# Altium project HU_revB.PrjPcb (part 2 of 4)

## Sheet 5V_REG.SchDoc
size B; SheetNumber: 5; SheetTotal: 17
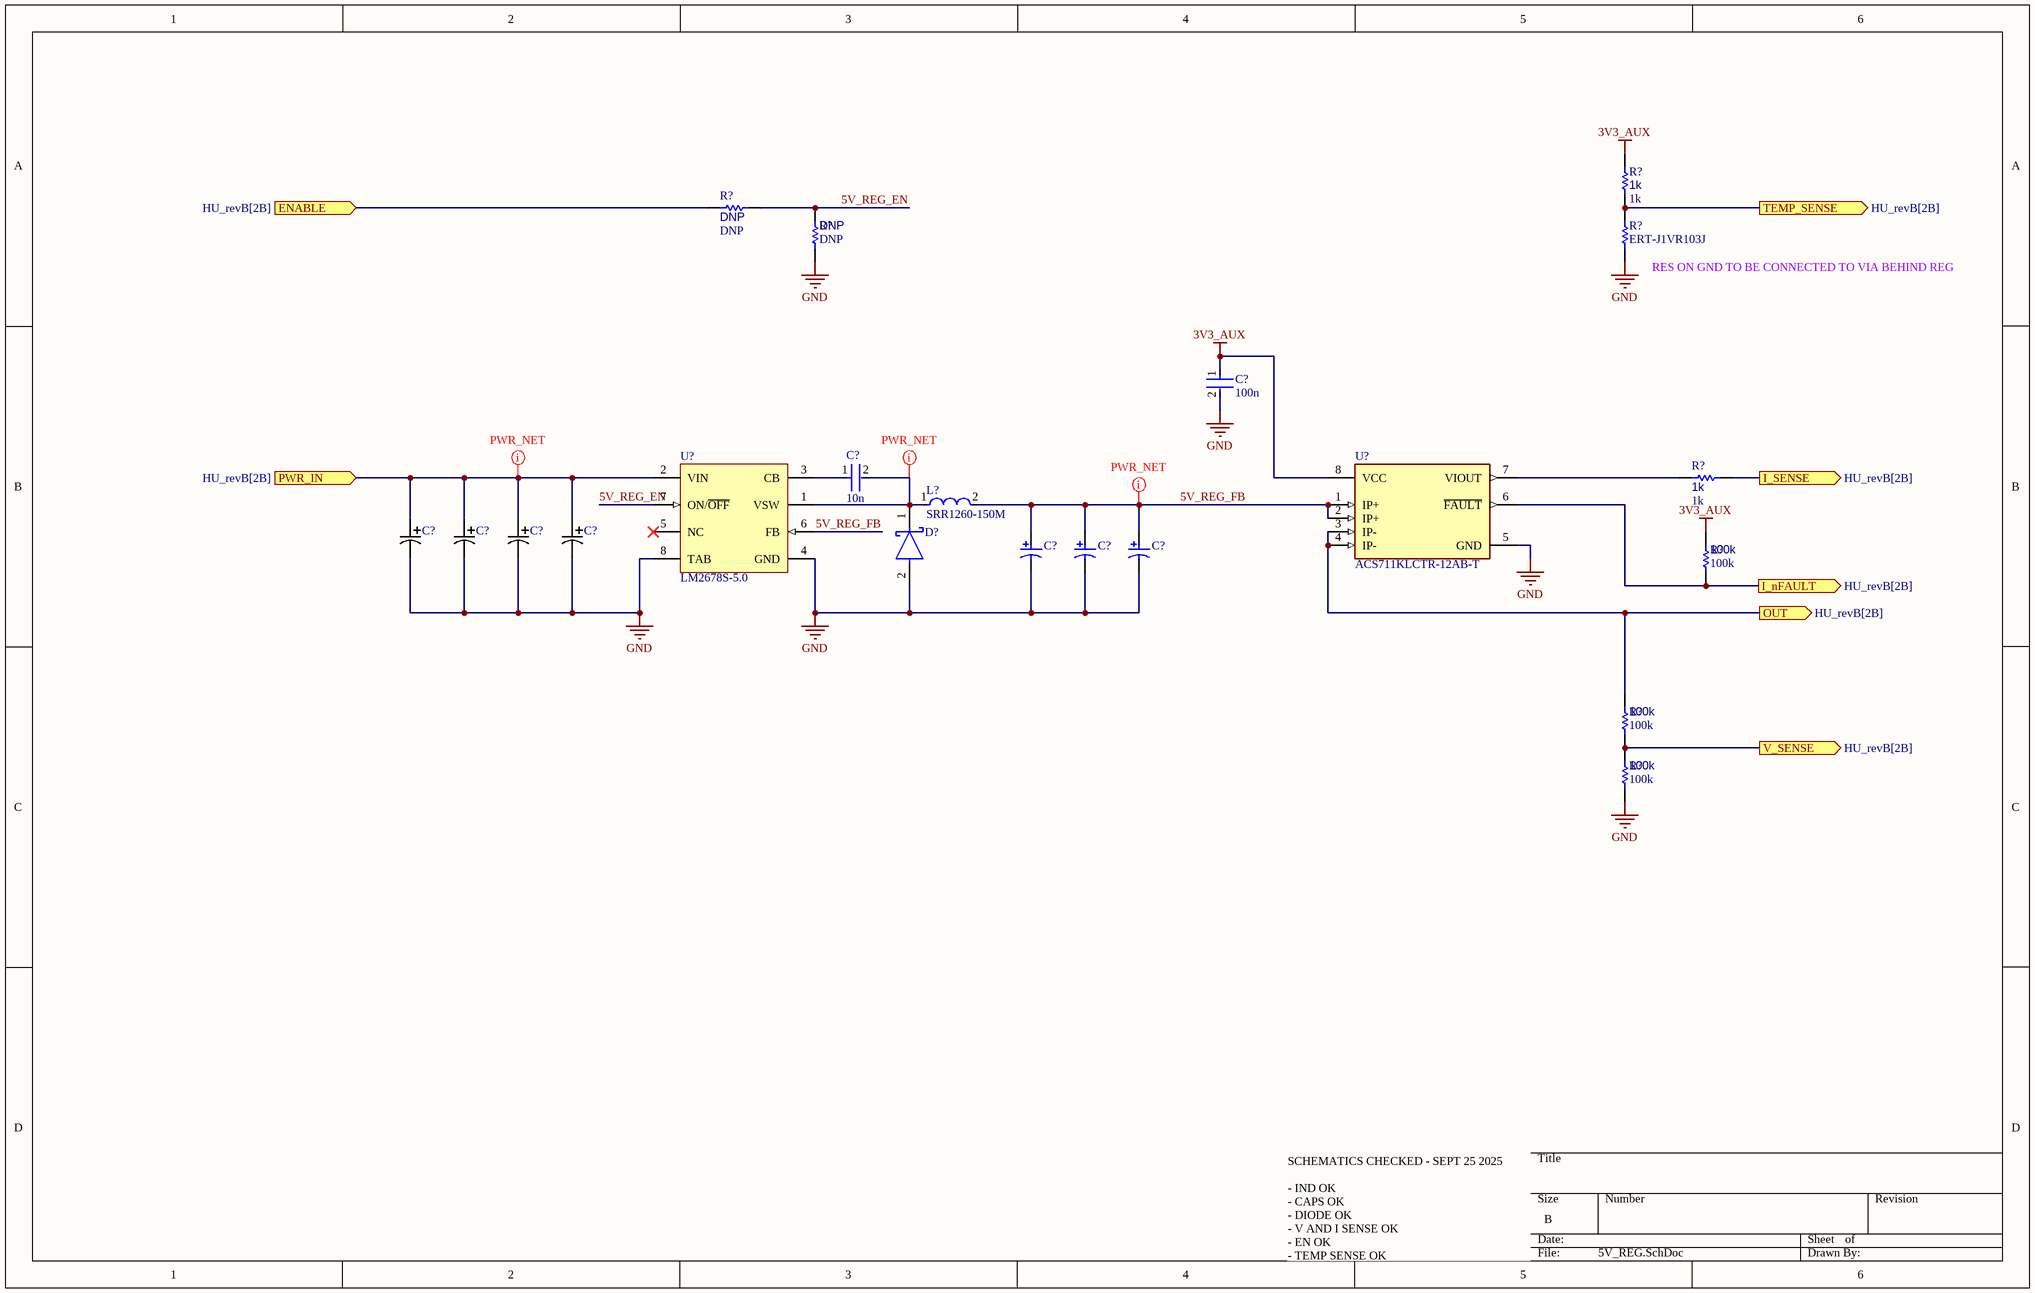
[diagram p5: 5V_REG.SchDoc]

### Parts
(Parts that share a designator on the sheet are numbered #1, #2 ... from top to bottom, then left to right.)
C36  100n  [FP-0402-L_1_0_0_05-W_0_5-IPC_A]
C37  10n  [FP-0402-L_1_0_0_05-W_0_5-IPC_A]
C?#1  T495D106M035ATE260  [T495D106M035ATE260-Footprint-1]  (value not drawn)
C?#2  T495D106M035ATE260  [T495D106M035ATE260-Footprint-1]  (value not drawn)
C?#3  T495D106M035ATE260  [T495D106M035ATE260-Footprint-1]  (value not drawn)
C?#4  T495D106M035ATE260  [T495D106M035ATE260-Footprint-1]  (value not drawn)
C?#5  T495D157K010ATE100  [KEMT-T495-D_L]  (value not drawn)
C?#6  T495D157K010ATE100  [KEMT-T495-D_L]  (value not drawn)
C?#7  T495D157K010ATE100  [KEMT-T495-D_L]  (value not drawn)
D7  B540C-13-F  [FP-SMC-MFG]  (value not drawn)
L?#1  SRR1260-150M  [FP-SRR1260-MFG]
R40  1k  [R0603B]
R41  DNP  [R0603B]
R42  DNP  [R0603B]
R43  ERT-J1VR103J  [RESC1608X90X30ML15T20]
R44  1k  [R0603B]
R45  100k  [R0603B]
R46  100k  [R0603B]
R47  100k  [R0603B]
U4  LM2678S-5.0  [KTW0007B_N]
U5  ACS711KLCTR-12AB-T  [FP-LC-8-IPC_C]

### Ports
ENABLE (in, see HU_revB[2B]), I_nFAULT (out, see HU_revB[2B]), I_SENSE (out, see HU_revB[2B]), OUT (out, see HU_revB[2B]), PWR_IN (in, see HU_revB[2B]), TEMP_SENSE (out, see HU_revB[2B]), V_SENSE (out, see HU_revB[2B])

### Nets
3V3_AUX: C36.1 R40.1 R45.2 U5.8(VCC)  [project net GPIO_VREF]
5V_MAIN: R46.2 U5.3(IP-) U5.4(IP-) ; port OUT
GND: C36.2 C?#1.2 C?#2.2 C?#3.2 C?#4.2 C?#5.2 C?#6.2 C?#7.2 D7.2(A) R42.1 R43.1 R47.1 U4.4(GND) U4.8(TAB) U5.5(GND)
5V_REG_EN: R41.1 R42.2 U4.7(ON/~{OFF})
5V_REG_FB: C?#5.1 C?#6.1 C?#7.1 L?#1.2 U4.6(FB) U5.1(IP+) U5.2(IP+)
CAN_INH: R41.2 ; port ENABLE
NetC37_1: C37.1 U4.3(CB)
NetC37_2: C37.2 D7.1(C) L?#1.1 U4.1(VSW)
NetC?#1_1: C?#1.1 C?#2.1 C?#3.1 C?#4.1 U4.2(VIN) ; port PWR_IN
NetR40_2: R40.2 R43.2 ; port TEMP_SENSE
NetR44_1: R44.1 ; port I_SENSE
NetR44_2: R44.2 U5.7(VIOUT)
NetR45_1: R45.1 U5.6(~{FAULT}) ; port I_nFAULT
NetR46_1: R46.1 R47.2 ; port V_SENSE

Not connected (* = marked no-connect by the designer): U4 5(NC)*

### Layout directives
net class PWR: 5V_REG_FB, NetC37_2, NetC?#1_1

### Notes on the sheet
- (near R43) RES ON GND TO BE CONNECTED TO VIA BEHIND REG
- SCHEMATICS CHECKED - SEPT 25 2025
  - IND OK
  - CAPS OK
  - DIODE OK
  - V AND I SENSE OK
  - EN OK
  - TEMP SENSE OK

### Library data of the parts
C36 C37 = CMP-001-00058-1: as C35 on sheet HU_revB; Min Operating Temperature: -55°C; Mounting Technology: Surface Mount; Pins: 2; Case/Package: 0402; RoHS Compliant: Yes; Max Operating Temperature: 85°C
C?#1-C?#4 = CMP-001-00065-1: Tantalum Capacitor, Polarized, Tantalum (dry/solid), 35V, 20% +Tol, 20% -Tol, 10uF, Surface Mount, 2917; Value: 10µF; Case/Package: Molded; Mounting Technology: Surface Mount; Max Operating Temperature: 125°C; Tolerance: 20%; Min Operating Temperature: -55°C
C?#5-C?#7 = CMP-2000-07208-1: Capacitor, Tantalum, 150 uF, +/- 10%, 10 V, -55 to 125 degC, 2-Pin SMD, RoHS, Tape and Reel; Manufacturer: Kemet; Capacitance: 150µF; ESR: 0.1ohm; Voltage Rating: 10V; Capacitor Case Style: 2917; Package Description: 2-Pin Surface Mount Device, Body 7.3 x 4.3 mm; MSL: MSL1-Unlimited; Package Reference: T495-D; Mounting Technology: SurfaceMount; Datasheet URL: http://capacitoredge.kemet.com/capedge2/DataSheet/Datasheet-T495D157K010ATE100.pdf?pn=T495D157K010ATE100; Datasheet Version: 09/2016; Capacitance Tolerance: ±10%; Capacitor Terminals: SMD; Operating Temperature Range: -55°Cto+125°C; Manufacturer URL: http://www.kemet.com/
D7 = CMP-2000-05097-3: DIODE SCHOTTKY 40V 5A SMC; Manufacturer: Diodes Inc.; Automotive Grade: NA; Peak Reverse Current: 0.5mA; Value: 300pF; Max Junction Temp: +150°C; Max Surge Forward Current: 100A; Standoff Height: 0.1mm; Digikey Description: DIODE SCHOTTKY 40V 5A SMC; Temperature Range Low: -55°C; Manufacturer Part Number: B540C-13-F; Octopart: https://octopart.com/b540c-13-f-diodes+inc.-325873; Lead Free: Yes; Reverse Voltage: 40V; RoHS: TRUE; Category: Diode; Mouser Description: Diode: Schottky rectifying; SMD; 40V; 5A; SMC; Package: reel, tape; ComponentLink2Description: Datasheet; Temperature Range High: +150°C; Automotive: No; Footprint Url: https://www.diodes.com/assets/Package-Files/SMC.pdf; Device Class L3: Schottky Diodes; Height: 2.5mm; Forward Current: 5A; Temperature: -55°C to +150°C; Package: SMC; ComponentLink2URL: https://www.diodes.com/assets/Datasheets/ds13012.pdf; Device Class L2: Diodes; Max Repetitive Reverse Voltage: 40V; Device Class L1: Discrete Semiconductors; Capacitance: 300pF
L?#1 = CMP-2000-07146-2: FIXED IND 15UH 5A 27 MOHM SMD; Q Factor: 25; Sample Rate (Hz): 100kHz; Resistance: 27MR; Material: Steel; Inductance Tolerance: 20%; Frequency: 17.6MHz; Saturation Current: 4.6A; Core Material: Ferrite; Shielding: Shielded; Series: SRR1260; Termination: SMD/SMT; Packaging: Tape and Reel; RoHS Compliant: Yes; Height - Seated (Max): 0.256inch; Depth: 12.8mm; Case/Package: 1260; Inductance: 15uH; Height: 6mm; Number of Pins: 2; Mount: Surface Mount; Min Operating Temperature: -40°C; Test Frequency: 100kHz; Length: 12.5mm; Self Resonant Frequency: 17.6MHz; Current Rating: 5A; Tolerance: 20%; RMS Current (Irms): 5A; REACH SVHC: No SVHC; Resistor Type: Wirewound; DC Resistance (DCR): 27mR; Width: 12.5mm; Package Quantity: 600; DC Current: 5A; Max DC Current: 5A; Max Operating Temperature: 125°C; Military Standard: Not
R40-R42 R44-R47 = CMP-009-00002-14: Resistor
  R?#27 R?#31: Value: 1k
  R?#28 R?#29: Value: DNP
  R?#32-R?#34: Value: 100k
R43 = CMP-2000-00869-1: Manufacturer: Panasonic; Part Number: ERT-J1VR103J
U4 = CMP-0069-00190-3: SIMPLE SWITCHER® High Efficiency 5A Step-Down Voltage Regulator, 7-pin TO-263; Manufacturer: Texas Instruments; PowerWise: N; PackageTopMarking: NSUZXYTTE#*LM2678*S-5.0; RoHS: N; PinCount: 7; Code_JEDEC: MO-169-AC; ComponentLink1URL: http://www.ti.com/general/docs/lit/getliterature.tsp?genericPartNumber=LM2678&fileType=pdf; ComponentLink1Description: Datasheet URL; PackageReference: KTW0007B; PackageDescription: TO-263, Molded, .400 x .390 x .180in Body, 7 Lead, .050in Pitch, Surface Mount; CompType: Switcher
U5 = CMP-1557-00012-2: SENSOR CURRENT HALL 12.5A AC/DC; Number of Channels: 1; Min Supply Voltage: 3V; Sensitivity: 110mV/A; Response Time: 4.6us; Operating Supply Voltage: 3.3V; Max Supply Voltage: 5.5V; Max Supply Current: 5.5mA; Bandwidth: 100kHz; Linearity: 1%; Quiescent Current: 4mA; Accuracy: 5%; Polarity: Bidirectional; Case/Package: SOIC; Packaging: Tape and Reel; Number of Pins: 8; Width: 3.9mm; Frequency: 100kHz; -3db Bandwidth: 100kHz; REACH SVHC: No SVHC; Series: -; Height: 1.5mm; Package Quantity: 1; Min Operating Temperature: -40°C; Max Operating Temperature: 125°C; Current Sensing: 12.5A; RoHS Compliant: Yes; Length: 4.9mm

## Sheet NVME.SchDoc
size C; SheetNumber: 6; SheetTotal: 17
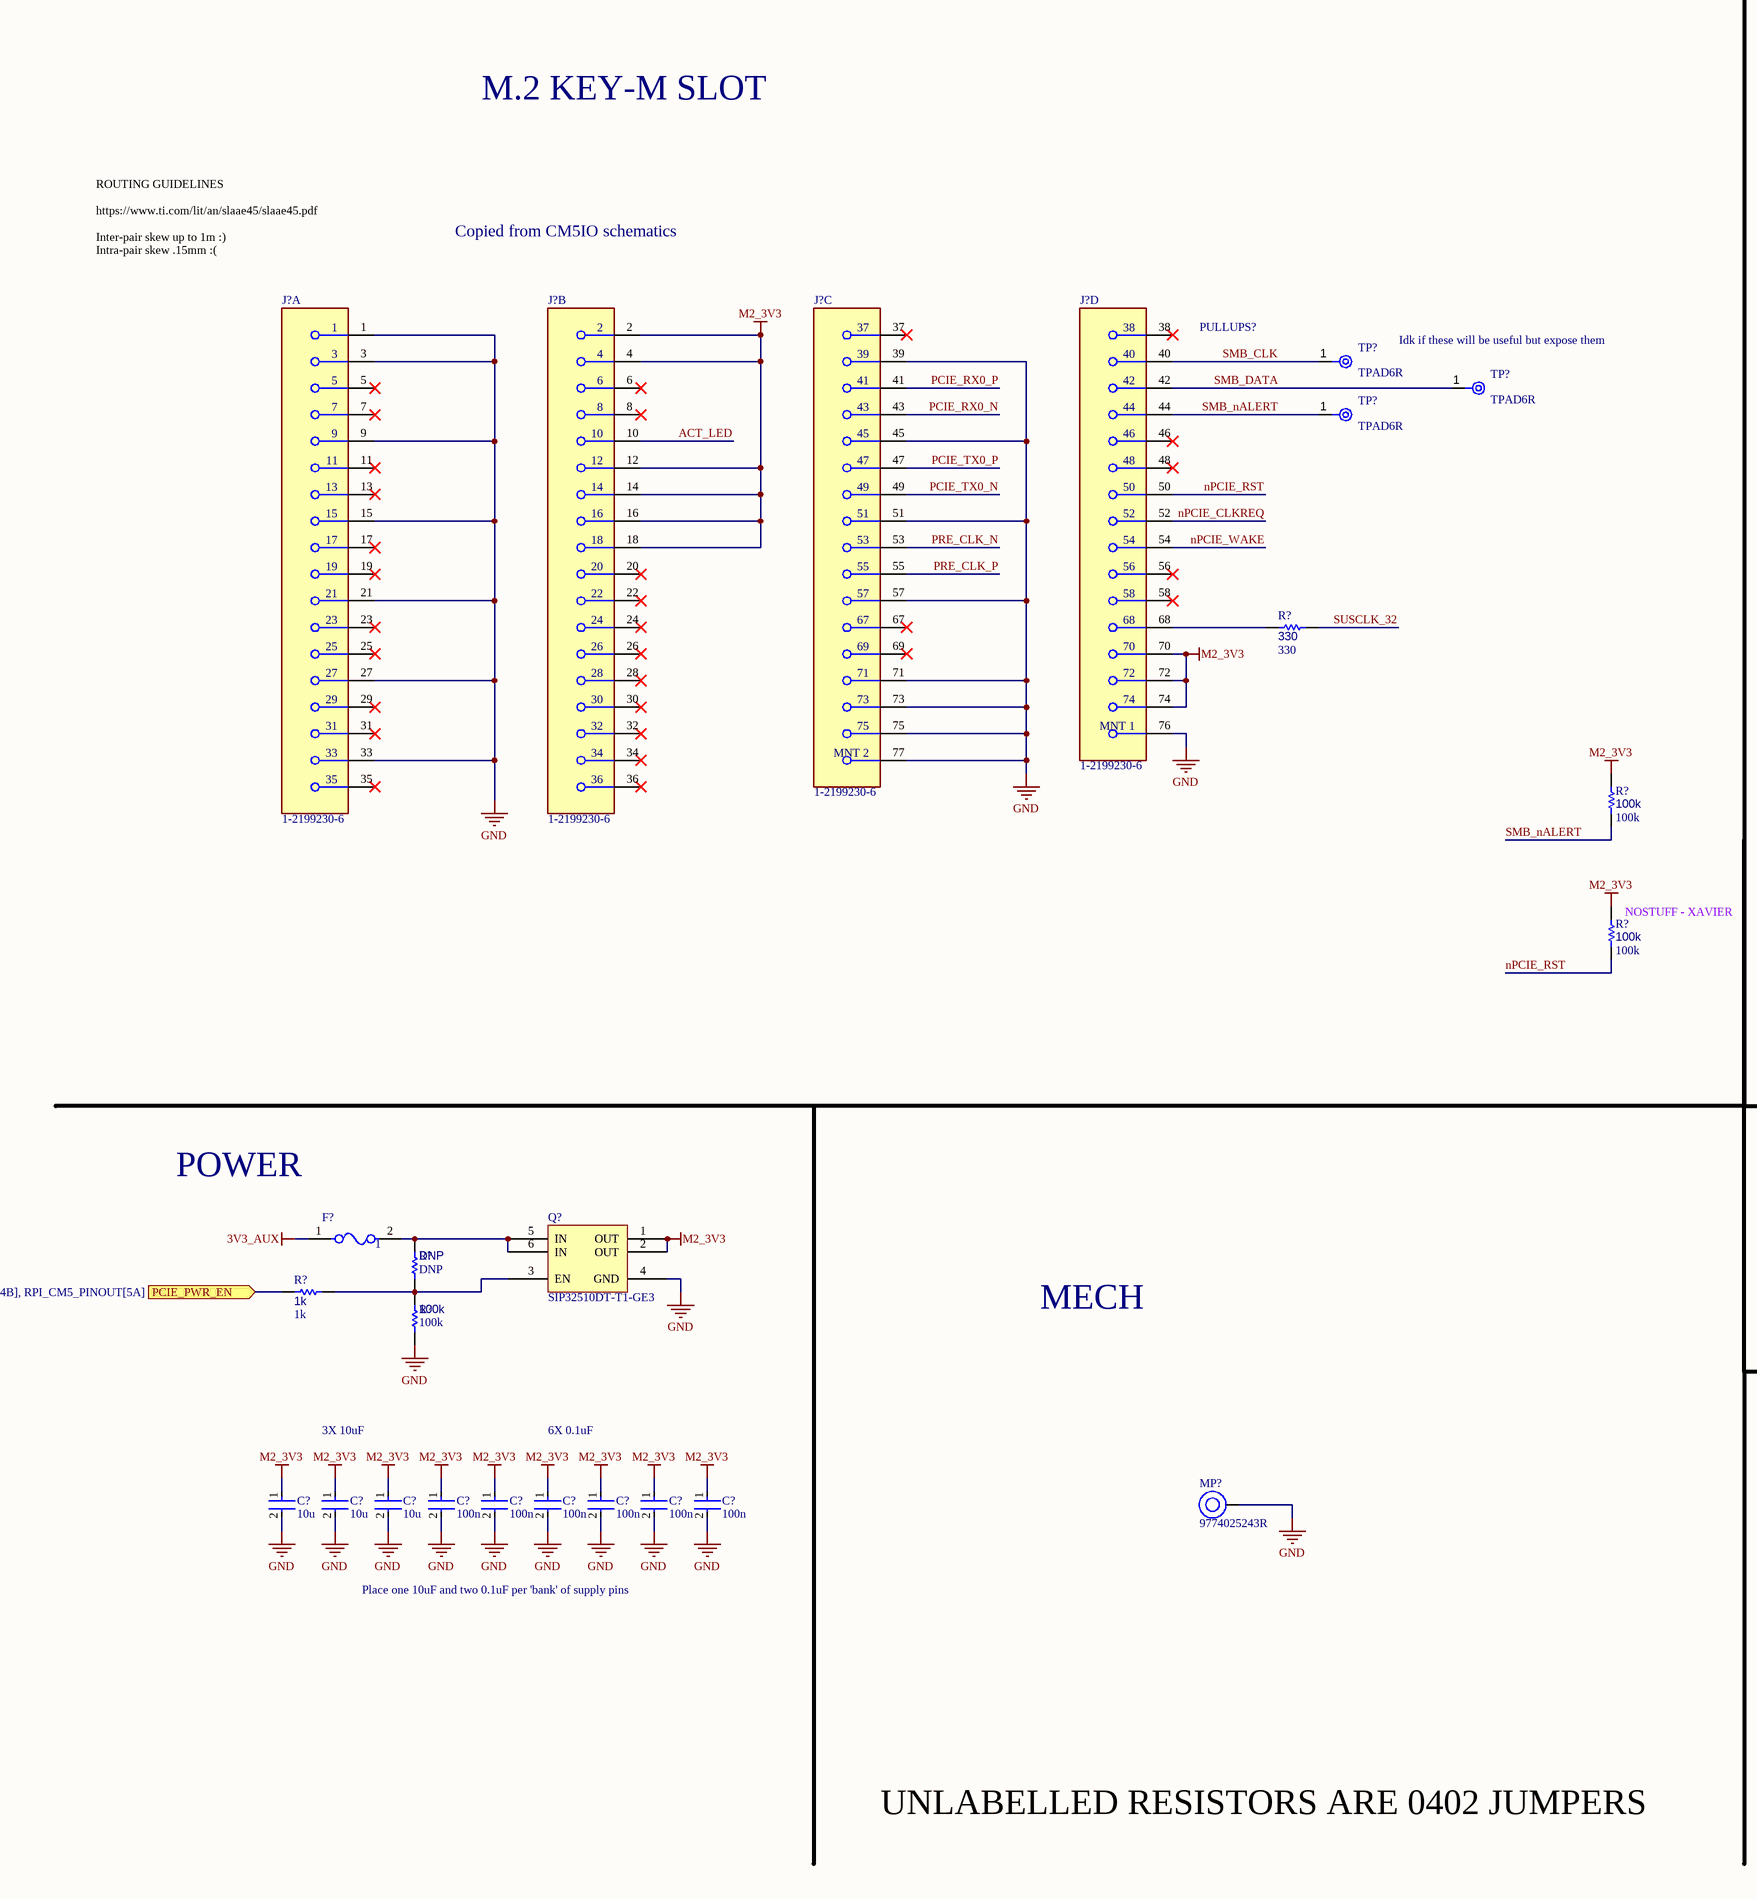
[diagram p6: NVME.SchDoc, left]
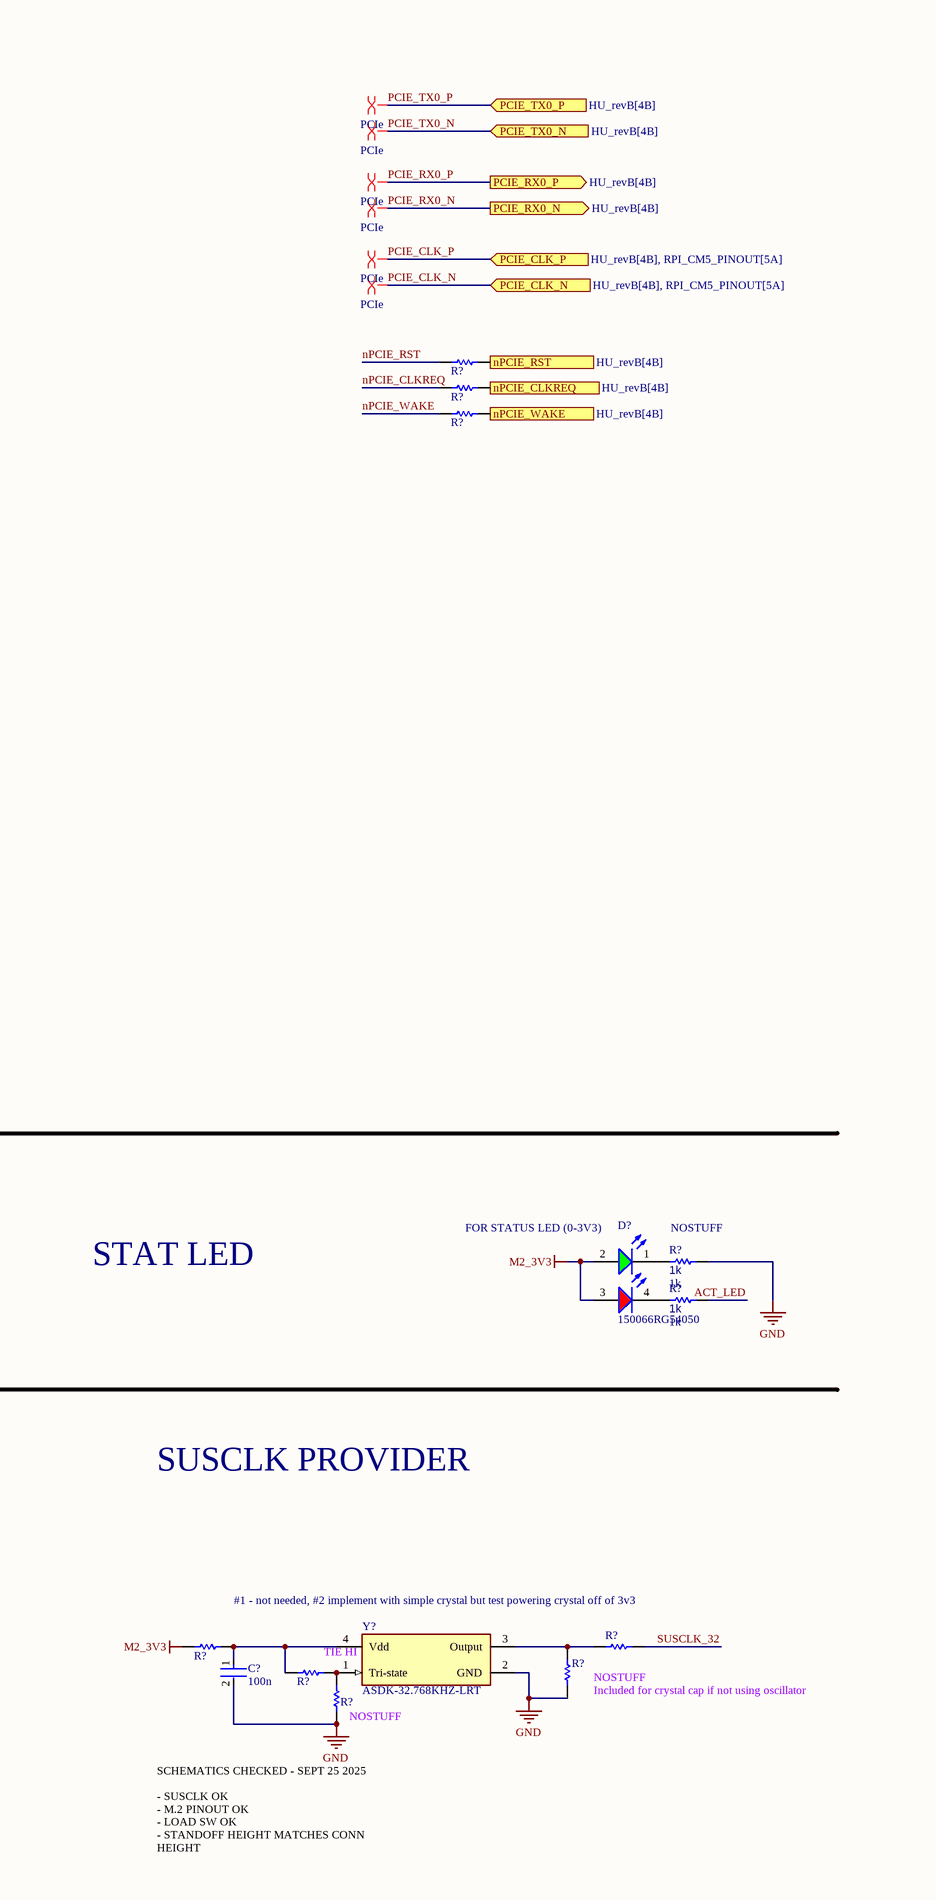
[diagram p7: NVME.SchDoc, right]

### Parts
(Parts that share a designator on the sheet are numbered #1, #2 ... from top to bottom, then left to right.)
C45  10u  [FP-0402-L_1_0_0_05-W_0_5-IPC_A]
C46  10u  [FP-0402-L_1_0_0_05-W_0_5-IPC_A]
C47  10u  [FP-0402-L_1_0_0_05-W_0_5-IPC_A]
C48  100n  [FP-0402-L_1_0_0_05-W_0_5-IPC_A]
C49  100n  [FP-0402-L_1_0_0_05-W_0_5-IPC_A]
C50  100n  [FP-0402-L_1_0_0_05-W_0_5-IPC_A]
C51  100n  [FP-0402-L_1_0_0_05-W_0_5-IPC_A]
C52  100n  [FP-0402-L_1_0_0_05-W_0_5-IPC_A]
C53  100n  [FP-0402-L_1_0_0_05-W_0_5-IPC_A]
C54  100n  [FP-0402-L_1_0_0_05-W_0_5-IPC_A]
D8  150066RG54050  [WL-SBCD_0606]
F8  1  [FP-0685T-MFG]
J10  1-2199230-6  [FP-1-2199230-6-MFG]  (part D of 4)
J?#4  1-2199230-6  [FP-1-2199230-6-MFG]  (part A of 4)
J?#5  1-2199230-6  [FP-1-2199230-6-MFG]  (part B of 4)
J?#6  1-2199230-6  [FP-1-2199230-6-MFG]  (part C of 4)
MP1  9774025243R  [9774025243]
Q?#2  SIP32510DT-T1-GE3  [SOT95P284X110-6N]
R48  0402 JUMPER  [RESC1005X40X25ML05T05]  (value not drawn)
R49  0402 JUMPER  [RESC1005X40X25ML05T05]  (value not drawn)
R50  0402 JUMPER  [RESC1005X40X25ML05T05]  (value not drawn)
R52  330  [R0603B]
R53  100k  [R0603B]
R54  100k  [R0603B]
R55  1k  [R0603B]
R56  1k  [R0603B]
R57  0402 JUMPER  [RESC1005X40X25ML05T05]  (value not drawn)
R58  0402 JUMPER  [RESC1005X40X25ML05T05]  (value not drawn)
R59  0402 JUMPER  [RESC1005X40X25ML05T05]  (value not drawn)
R60  0402 JUMPER  [RESC1005X40X25ML05T05]  (value not drawn)
R61  0402 JUMPER  [RESC1005X40X25ML05T05]  (value not drawn)
R?#2  DNP  [R0603B]
R?#3  1k  [R0603B]
R?#4  100k  [R0603B]
TP1  TPAD6R  [New footprint 1]
TP2  TPAD6R  [New footprint 1]
TP3  TPAD6R  [New footprint 1]
Y2  ASDK-32.768KHZ-LRT  [FP-ASDK-MFG]

### Ports
nPCIE_CLKREQ (out, see HU_revB[4B]), nPCIE_RST (in, see HU_revB[4B]), nPCIE_WAKE (out, see HU_revB[4B]), PCIE_CLK_N (in, see HU_revB[4B], RPI_CM5_PINOUT[5A]), PCIE_CLK_P (in, see HU_revB[4B], RPI_CM5_PINOUT[5A]), PCIE_PWR_EN (in, see HU_revB[4B], RPI_CM5_PINOUT[5A]), PCIE_RX0_N (out, see HU_revB[4B]), PCIE_RX0_P (out, see HU_revB[4B]), PCIE_TX0_N (in, see HU_revB[4B]), PCIE_TX0_P (in, see HU_revB[4B])

### Nets
3V3_AUX: F8.1  [project net GPIO_VREF]
GND: C45.2 C46.2 C47.2 C48.2 C49.2 C50.2 C51.2 C52.2 C53.2 C54.2 J10.76(MNT_1) J?#4.1 J?#4.3 J?#4.9 J?#4.15 J?#4.21 J?#4.27 J?#4.33 J?#6.39 J?#6.45 J?#6.51 J?#6.57 J?#6.71 J?#6.73 J?#6.75 J?#6.77(MNT_2) MP1.1 Q?#2.4(GND) R55.2 R59.1 R61.1 R?#4.1 Y2.2(GND)
M2_3V3: C45.1 C46.1 C47.1 C48.1 C49.1 C50.1 C51.1 C52.1 C53.1 D8.2(A) D8.3(A) J10.70 J10.72 J10.74 J?#5.2 J?#5.4 J?#5.12 J?#5.14 J?#5.16 J?#5.18 Q?#2.1(OUT) Q?#2.2(OUT) R53.1 R54.1 R58.1
ACT_LED: J?#5.10 R56.2
nPCIE_CLKREQ: J10.52 R49.1
nPCIE_RST: J10.50 R48.1 R54.2
nPCIE_WAKE: J10.54 R50.1
PCIE_nCLKREQ: R49.2 ; port nPCIE_CLKREQ
PCIE_nRST: R48.2 ; port nPCIE_RST
PCIE_nWAKE: R50.2 ; port nPCIE_WAKE
PCIE_PWR_EN: R?#3.2 ; port PCIE_PWR_EN
PCIE_RX0_N: J?#6.43 ; port PCIE_RX0_N
PCIE_RX0_P: J?#6.41 ; port PCIE_RX0_P
PCIE_TX0_N: J?#6.49 ; port PCIE_TX0_N
PCIE_TX0_P: J?#6.47 ; port PCIE_TX0_P
PRE_CLK_N: J?#6.53
PRE_CLK_P: J?#6.55
SMB_CLK: J10.40 TP1.1(TP)
SMB_DATA: J10.42 TP2.1(TP)
SMB_nALERT: J10.44 R53.2 TP3.1(TP)
SUSCLK_32: R52.1 R57.1
NetC54_1: C54.1 R58.2 R60.1 Y2.4(Vdd)
NetD8_1: D8.1(K) R55.1
NetD8_4: D8.4(K) R56.1
NetF8_2: F8.2 Q?#2.5(IN) Q?#2.6(IN) R?#2.2
NetJ10_68: J10.68 R52.2
NetQ?#2_3: Q?#2.3(EN) R?#2.1 R?#3.1 R?#4.2
NetR57_2: R57.2 R59.2 Y2.3(Output)
NetR60_2: R60.2 R61.2 Y2.1(Tri-state)

Not connected (* = marked no-connect by the designer): J10 38* 46* 48* 56* 58*; J?#4 5* 7* 11* 13* 17* 19* 23* 25* 29* 31* 35*; J?#5 6* 8* 20* 22* 24* 26* 28* 30* 32* 34* 36*; J?#6 37* 67* 69*

### Layout directives
differential pair; differential pair class PCIe: PCIE_CLK_N, PCIE_CLK_P, PCIE_RX0_N, PCIE_RX0_P, PCIE_TX0_N, PCIE_TX0_P

### Notes on the sheet
- M.2 KEY-M SLOT
- ROUTING GUIDELINES
  https://www.ti.com/lit/an/slaae45/slaae45.pdf
  Inter-pair skew up to 1m :)
  Intra-pair skew .15mm :(
- Copied from CM5IO schematics
- PULLUPS?
- (near TP2) Idk if these will be useful but expose them
- (near R54) NOSTUFF - XAVIER
- POWER
- STAT LED
- (near D8) FOR STATUS LED (0-3V3)
- (near R55) NOSTUFF
- MECH
- 3X 10uF
- 6X 0.1uF
- SUSCLK PROVIDER
- Place one 10uF and two 0.1uF per 'bank' of supply pins
- #1 - not needed, #2 implement with simple crystal but test powering crystal off of 3v3
- (near Y2) TIE HI
- (near R61) NOSTUFF
- (near R59) NOSTUFF
- (near R59) Included for crystal cap if not using oscillator
- UNLABELLED RESISTORS ARE 0402 JUMPERS
- SCHEMATICS CHECKED - SEPT 25 2025
  - SUSCLK OK
  - M.2 PINOUT OK
  - LOAD SW OK
  - STANDOFF HEIGHT MATCHES CONN HEIGHT

### Library data of the parts
C45-C54 = CMP-001-00058-1: as C35 on sheet HU_revB; Min Operating Temperature: -55°C; Mounting Technology: Surface Mount; Pins: 2; Case/Package: 0402; RoHS Compliant: Yes; Max Operating Temperature: 85°C
D8 = CMP-004-00040-2: as D6 on sheet RPI_CM5_PINOUT; Source: rgled.SchLib; Component Type: Standard; Pins: 4; Design Item ID: CMP-004-00034-2
F8 = CMP-16042-000006-1: FUSE BOARD MNT 5A 63VAC/VDC 1206; RoHS Compliant: Yes
J10 J?#4-J?#6 = CMP-03365-000001-1: CONN EDGE DUAL FMALE 67POS 0.020; Manufacturer: TE; Number Of Contacts: 67; Current Rating: 0.5A; Pitch: 0.5mm; Conn Gender: Female; Is Female: yes; Voltage Rating: 50V; Conn Orientation: Right Angle; Automotive: No; Temperature Range High: +80°C; Package: 1-2199230-6; Category: Conn; Temperature: -40°C to +80°C; Number Of Rows: 2; ComponentLink2URL: http://www.te.com/commerce/DocumentDelivery/DDEController?Action=showdoc&DocId=Specification+Or+Standard%7F114-115006%7FB%7Fpdf%7FEnglish%7FENG_SS_114-115006_B_114-115006_REV_B.pdf%7F1-2199230-6; Manufacturer Part Number: 1-2199230-6; Height: 4.2mm; RoHS: TRUE; Footprint Url: http://www.te.com/commerce/DocumentDelivery/DDEController?Action=showdoc&DocId=Customer+Drawing%7F2199230%7FB2%7Fpdf%7FEnglish%7FENG_CD_2199230_B2.pdf%7F1-2199230-6; Digikey Description: CONN EDGE DUAL FMALE 67POS 0.020; Device Class L2: Card Edge Connectors; Contact Material: Gold,Tin; Device Class L1: Connectors; Device Class L3: unset; ComponentLink2Description: Datasheet; Temperature Range Low: -40°C; Octopart: https://octopart.com/1-2199230-6-te+connectivity-34969376; Lead Free: Yes
MP1 = CMP-03913-59774857-1: 9774025243R Spacer Material: Steel, Tin-Plated Mounting: SMT Series: WA-SMST Thread D: M2; Outside Diameter: 4.3434mm; Threaded/Unthreaded: Threaded; Plating: Tin; REACH SVHC: Unknown; NexarPartId: 59774857; RoHS: Compliant; Material: Steel; Packaging: Tape and Reel; Max Operating Temperature: 150°C; Min Operating Temperature: -55°C; Length: 2.5mm; Height: 2.5mm
Q?#2 = CMP-019-00054-1: Power Switch ICs – Power Distribution; VISHAY; SIP32510DT-T1-GE3; 1; 1; 5.5 V; SOT-23-6; Max Supply Voltage: 5.5V; Max Power Dissipation: 833mW; Min Supply Voltage: 1.2V; Case/Package: SOT-23-6; Mounting Technology: Surface Mount; Max Operating Temperature: 85°C; Min Operating Temperature: -40°C
R48-R50 R57-R61 = CMP-009-00118-2: READ THE NAME; Pins: 2; Component Type: Standard; Design Item ID: CMP-009-00206-2; Source: 0402jump.SchLib
R52-R56 R?#2-R?#4 = CMP-009-00002-14: Resistor
  R?#38: Value: 330
  R?#39 R?#40 R?#45: Value: 100k
  R?#41 R?#43 R?#44: Value: 1k
  R?#42: Value: DNP
TP1-TP3 = CMP-00025-2: Test Point .6mm
Y2 = CMP-27762-001115-1: XTAL OSC XO 32.7680KHZ CMOS SMD; Load Capacitance: 15pF; Max Supply Current: 3.5mA; Min Supply Voltage: 2.97V; Operating Supply Voltage: 3.3V; Frequency Stability: 25ppm; Lead Free: Lead Free; Case/Package: CSMD; Number of Pins: 4; Max Operating Temperature: 85°C; Packaging: Tape and Reel; Width: 0.079inch; Min Operating Temperature: -40°C; Radiation Hardening: No; Length: 2.5mm; Depth: 2mm; Termination: SMD/SMT; Height: 0.037inch; Series: ASDK; Frequency: 32.768kHz; Mount: Surface Mount